# EAGLE schematic Schematics (EAGLE 6.2)
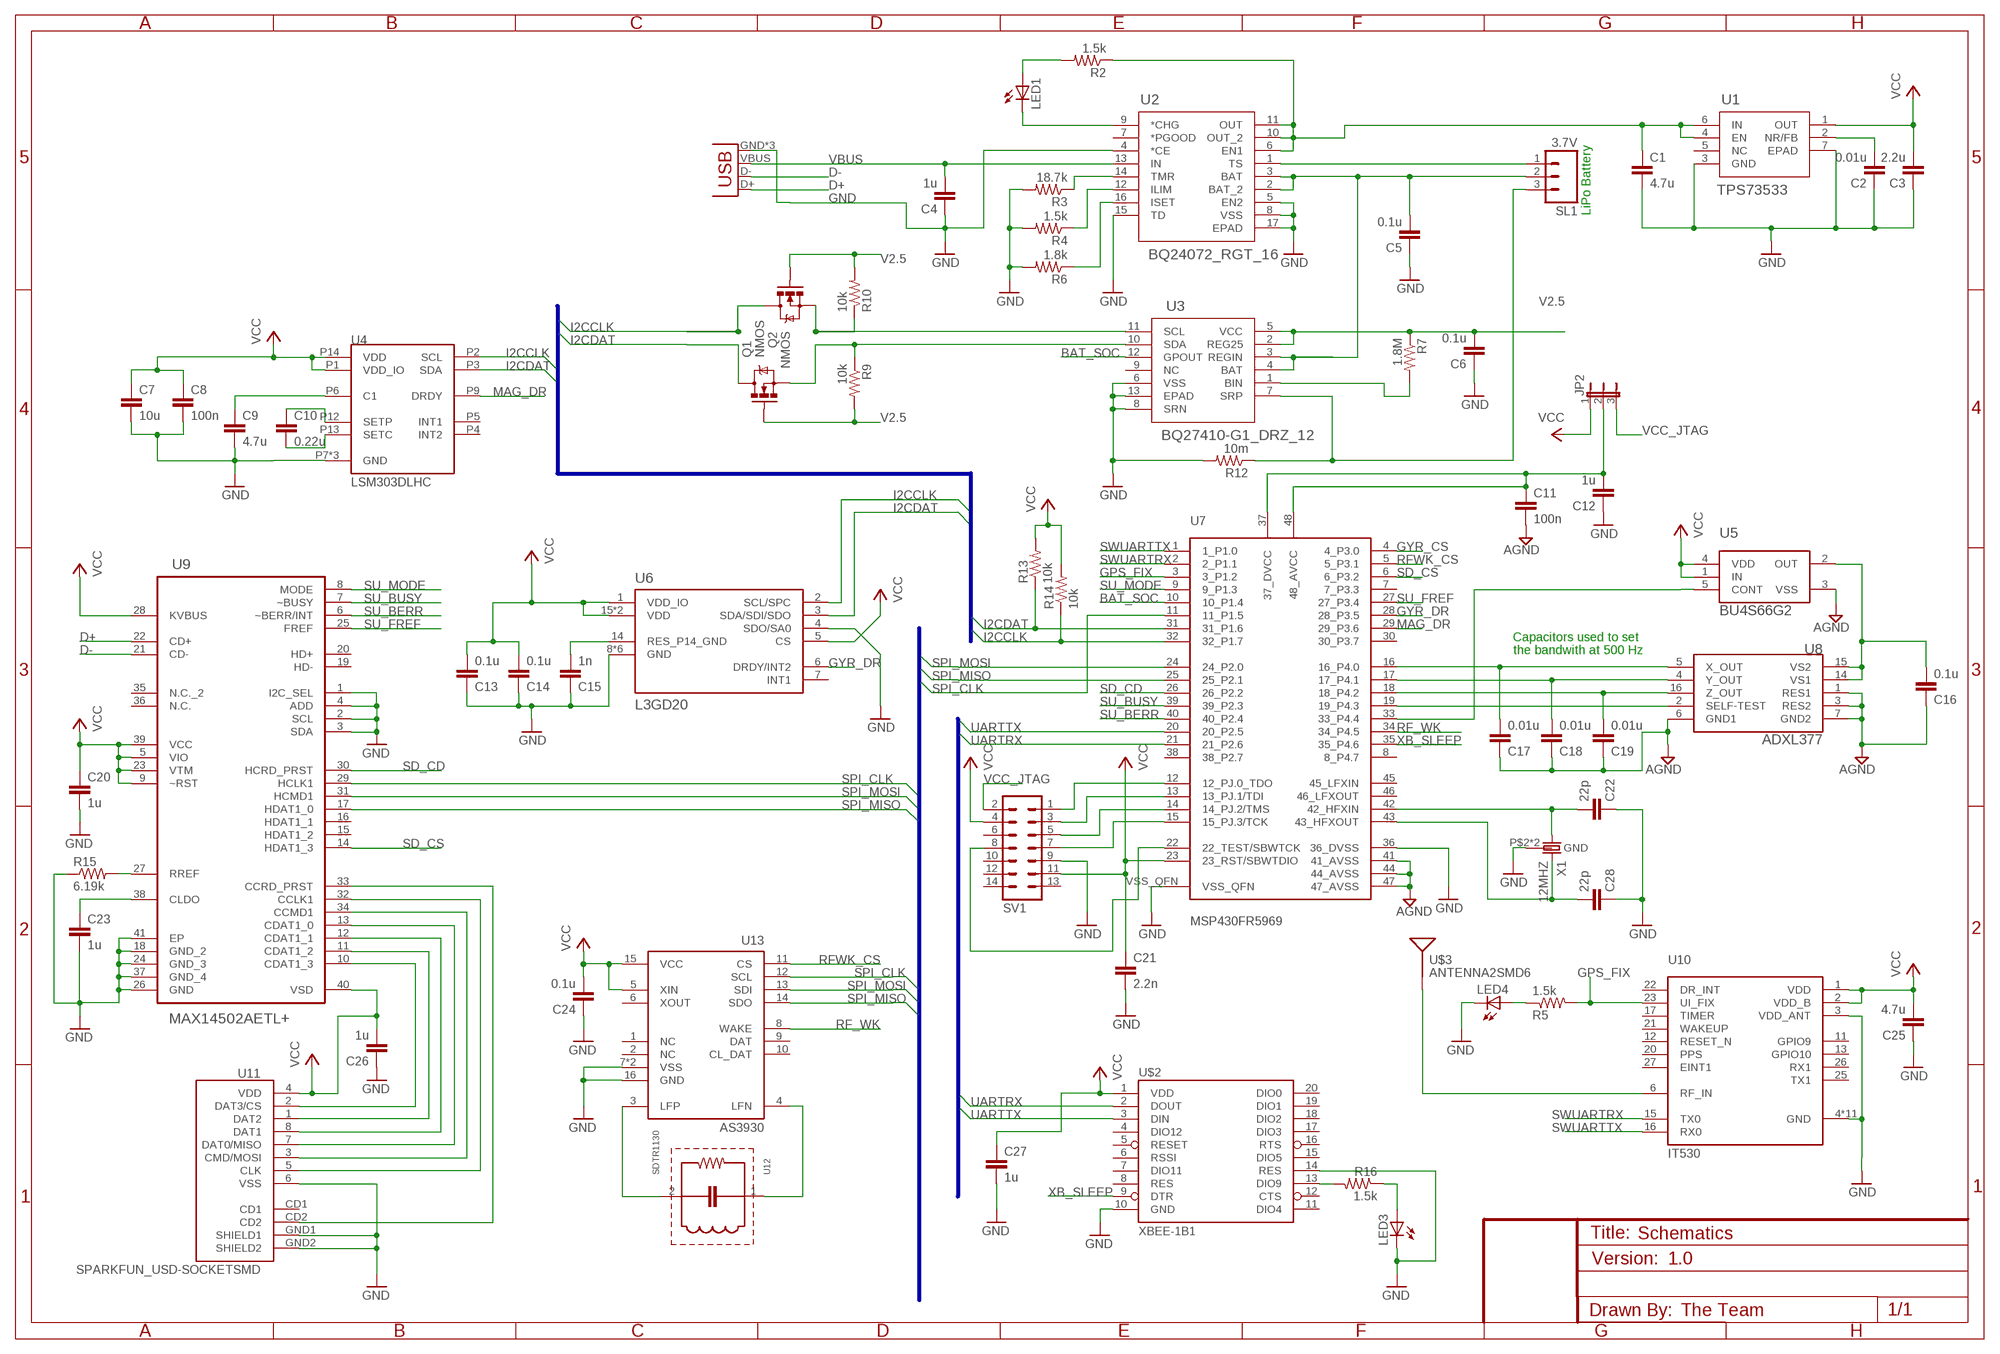
[diagram p0: schematic, sheet 1]

## Parts
C1  4.7u  C-EUC0603  [C0603]
C2  0.01u  C-EUC0603  [C0603]
C3  2.2u  C-EUC0603  [C0603]
C4  1u  C-EUC0603  [C0603]
C5  0.1u  C-EUC0603  [C0603]
C6  0.1u  C-EUC0603  [C0603]
C7  10u  C-EUC0603  [C0603]
C8  100n  C-EUC0603  [C0603]
C9  4.7u  C-EUC0603  [C0603]
C10  0.22u  C-EUC0603  [C0603]
C11  100n  C-EUC0603  [C0603]
C12  1u  C-EUC0603  [C0603]
C13  0.1u  C-EUC0603  [C0603]
C14  0.1u  C-EUC0603  [C0603]
C15  1n  C-EUC0603  [C0603]
C16  0.1u  C-EUC0603  [C0603]
C17  0.01u  C-EUC0603  [C0603]
C18  0.01u  C-EUC0603  [C0603]
C19  0.01u  C-EUC0603  [C0603]
C20  1u  C-EUC0603  [C0603]
C21  2.2n  C-EUC0603  [C0603]
C22  22p  C-EUC0603  [C0603]
C23  1u  C-EUC0603  [C0603]
C24  0.1u  C-EUC0603  [C0603]
C25  4.7u  C-EUC0603  [C0603]
C26  1u  C-EUC0603  [C0603]
C27  1u  C-EUC0603  [C0603]
C28  22p  C-EUC0603  [C0603]
JP1  USB-MICROB  [USB-MICROB]
JP2  JP2E  [JP2]
LED1  LED  [SMARTLED-TTW]
LED3  LED  [SMARTLED-TTW]
LED4  LED  [SMARTLED-TTW]
Q1  NMOS  MOSFET-NCHANNELBSS138  [SOT23]
Q2  NMOS  MOSFET-NCHANNELBSS138  [SOT23]
R2  1.5k  R-US_R0603  [R0603]
R3  18.7k  R-US_R0603  [R0603]
R4  1.5k  R-US_R0603  [R0603]
R5  1.5k  R-US_R0603  [R0603]
R6  1.8k  R-US_R0603  [R0603]
R7  1.8M  R-US_R0603  [R0603]
R9  10k  R-US_R0603  [R0603]
R10  10k  R-US_R0603  [R0603]
R12  10m  R-US_R0603  [R0603]
R13  10k  R-US_R0603  [R0603]
R14  10k  R-US_R0603  [R0603]
R15  6.19k  R-US_R0603  [R0603]
R16  1.5k  R-US_R0603  [R0603]
SL1  3.7V  M03  [03P]
SV1  ML14L  [ML14L]
U1  TPS73533  TPS73533_DRV_6  [DRV6_1P6X1]
U2  BQ24072_RGT_16  [RGT16_1P7X1P7]
U3  BQ27410-G1_DRZ_12  [DRZ12_1P95X2P45]
U4  LSM303DLHC  [LGA_3X5X1_14L]
U5  BU4S66G2  [SSOP5]
U6  L3GD20  [L3GD20]
U7  MSP430FR5969  [RGZ(S-PQFP-N48)]
U8  ADXL377  [LFCSP-16]
U9  MAX14502AETL+  [QFN40P500X500X80-41N]
U10  IT530  [IT530]
U11  SPARKFUN_USD-SOCKETSMD  [SPARKFUN_MICRO-SD-SOCKET-PP]
U12  SDTR1130  [SDTR1130-SMD]
U13  AS3930  [AS3930]
U$2  XBEE-1B1  [XBEE-1]
U$3  ANTENNA2SMD6  [ANTENNA-CHIP6]
X1  12MHZ  [12MHZ]

## Nets
AGND: C11.2 C16.1 C17.1 C18.1 C19.1 U5.3(VSS) U7.41(41_AVSS) U7.44(44_AVSS) U7.47(47_AVSS) U8.1(RES1) U8.3(RES2) U8.6(GND1) U8.7(GND2)
BAT_SOC: U3.12(GPOUT) U7.10(10_P1.4)
D+: JP1.D+ U9.22(CD+)
D-: JP1.D- U9.21(CD-)
GND: C1.2 C2.1 C3.1 C4.1 C5.1 C6.1 C7.2 C8.2 C9.2 C12.1 C13.1 C14.1 C15.1 C20.2 C21.2 C22.1 C23.2 C24.1 C25.1 C26.1 C27.2 C28.1 JP1.GND JP1.MT1(GND) JP1.MT2(GND) LED3.C@1(C) LED4.C@1(C) R3.2 R4.2 R6.2 R12.2 R15.1 SV1.9 U1.3(GND) U1.7(EPAD) U2.4(*CE) U2.5(EN2) U2.8(VSS) U2.15(TD) U2.17(EPAD) U3.6(VSS) U3.8(SRN) U3.13(EPAD) U4.P7(GND) U4.P10(GND) U4.P11(GND) U6.4(SDO/SA0) U6.8(GND) U6.9(GND) U6.10(GND) U6.11(GND) U6.12(GND) U6.13(GND) U7.36(36_DVSS) U7.VSS_QFN U9.1(I2C_SEL) U9.2(SCL) U9.3(SDA) U9.4(ADD) U9.18(GND_2) U9.24(GND_3) U9.26(GND) U9.37(GND_4) U9.41(EP) U10.3(VDD_ANT) U10.4(GND) U10.5(GND) U10.7(GND) U10.8(GND) U10.9(GND) U10.10(GND) U10.14(GND) U10.18(GND) U10.19(GND) U10.24(GND) U10.28(GND) U11.6(VSS) U11.GND1(SHIELD1) U11.GND2(SHIELD2) U13.7(VSS) U13.16(GND) U13.EXP(VSS) U$2.10(GND) U$2.14(RES) X1.P$2(GND) X1.P$4(GND)
GPS_FIX: R5.2 U7.3(3_P1.2) U10.23(UI_FIX)
GYR_CS: U7.4(4_P3.0)
GYR_DR: U6.6(DRDY/INT2) U7.28(28_P3.5)
I2CCLK: Q2.3(D) R14.1 U4.P2(SCL) U6.2(SCL/SPC) U7.32(32_P1.7)
I2CDAT: Q1.3(D) R13.1 U4.P3(SDA) U6.3(SDA/SDI/SDO) U7.31(31_P1.6)
MAG_DR: U4.P9(DRDY) U7.29(29_P3.6)
N$1: U5.5(CONT) U7.33(33_P4.4)
N$2: C16.2 U5.2(OUT) U8.14(VS1) U8.15(VS2)
N$3: LED3.A@1(A) R16.1
N$4: R16.2 U$2.13(DIO9)
N$5: U7.19(19_P4.3) U8.2(SELF-TEST)
N$6: Q1.2(S) R9.1 U3.10(SDA)
N$7: LED1.C@1(C) U2.9(*CHG)
N$8: C15.2 U6.14(RES_P14_GND)
N$9: SV1.1 U7.12(12_PJ.0_TDO)
N$10: C11.1 C12.2 JP2.2 U7.37(37_DVCC) U7.48(48_AVCC)
N$11: SV1.3 U7.13(13_PJ.1/TDI)
N$12: C22.2 U7.42(42_HFXIN) X1.P$1
N$13: C1.1 R2.1 U1.4(EN) U1.6(IN) U2.6(EN1) U2.10(OUT_2) U2.11(OUT)
N$14: U10.6(RF_IN) U$3.1(SIGNAL)
N$15: C28.2 U7.43(43_HFXOUT) X1.P$3
N$16: U9.10(CDAT1_3) U11.2(DAT3/CS)
N$17: U9.11(CDAT1_2) U11.1(DAT2)
N$18: C17.2 U7.16(16_P4.0) U8.5(X_OUT)
N$19: U9.12(CDAT1_1) U11.8(DAT1)
N$20: C18.2 U7.17(17_P4.1) U8.4(Y_OUT)
N$21: C19.2 U7.18(18_P4.2) U8.16(Z_OUT)
N$22: R7.2 U3.1(BIN)
N$23: U9.13(CDAT1_0) U11.7(DAT0/MISO)
N$24: Q2.2(S) R10.1 U3.11(SCL)
N$25: C9.1 U4.P6(C1)
N$26: C10.1 U4.P12(SETP)
N$27: C10.2 U4.P13(SETC)
N$28: R6.1 U2.16(ISET)
N$29: R4.1 U2.12(ILIM)
N$30: R3.1 U2.14(TMR)
N$31: C2.2 U1.2(NR/FB)
N$32: U9.34(CCMD1) U11.3(CMD/MOSI)
N$33: R12.1 SL1.3 U3.7(SRP)
N$34: SV1.5 U7.14(14_PJ.2/TMS)
N$35: LED1.A@1(A) R2.2
N$37: U9.32(CCLK1) U11.5(CLK)
N$38: SV1.7 U7.15(15_PJ.3/TCK)
N$39: C5.2 SL1.2 U2.2(BAT_2) U2.3(BAT) U3.3(REGIN) U3.4(BAT)
N$40: SL1.1 U2.1(TS)
N$43: U9.33(CCRD_PRST) U11.CD2
N$44: SV1.8 U7.22(22_TEST/SBWTCK)
N$45: U12.2 U13.3(LFP)
N$46: R15.2 U9.27(RREF)
N$47: U12.1 U13.4(LFN)
N$48: C23.1 U9.38(CLDO)
N$49: LED4.A@1(A) R5.1
RF_WK: U7.34(34_P4.5) U13.8(WAKE)
RFWK_CS: U7.5(5_P3.1) U13.11(CS)
SD_CD: U7.26(26_P2.2) U9.30(HCRD_PRST)
SD_CS: U7.6(6_P3.2) U9.14(HDAT1_3)
SPI_CLK: U7.11(11_P1.5) U9.29(HCLK1) U13.12(SCL)
SPI_MISO: U7.25(25_P2.1) U9.17(HDAT1_0) U13.14(SDO)
SPI_MOSI: U7.24(24_P2.0) U9.31(HCMD1) U13.13(SDI)
SU_BERR: U7.40(40_P2.4) U9.6(~BERR/INT)
SU_BUSY: U7.39(39_P2.3) U9.7(~BUSY)
SU_FREF: U7.27(27_P3.4) U9.25(FREF)
SU_MODE: U7.9(9_P1.3) U9.8(MODE)
SWUARTRX: U7.2(2_P1.1) U10.15(TX0)
SWUARTTX: U7.1(1_P1.0) U10.16(RX0)
UARTRX: U7.21(21_P2.6) U$2.2(DOUT)
UARTTX: U7.20(20_P2.5) U$2.3(DIN)
V2.5: C6.2 Q1.1(G) Q2.1(G) R7.1 R9.2 R10.2 U3.2(REG25) U3.5(VCC)
VBUS: C4.2 JP1.VBUS U2.13(IN)
VCC: C3.2 C7.1 C8.1 C13.2 C14.2 C20.1 C21.1 C24.2 C25.2 C26.2 C27.1 JP2.1 R13.2 R14.2 SV1.4 SV1.11 U1.1(OUT) U4.P1(VDD_IO) U4.P14(VDD) U5.1(IN) U5.4(VDD) U6.1(VDD_IO) U6.5(CS) U6.15(VDD) U6.16(VDD) U7.23(23_RST/SBWTDIO) U9.5(VIO) U9.9(~RST) U9.23(VTM) U9.28(KVBUS) U9.39(VCC) U9.40(VSD) U10.1(VDD) U10.2(VDD_B) U11.4(VDD) U13.5(XIN) U13.15(VCC) U$2.1(VDD)
VCC_JTAG: JP2.3 SV1.2
XB_SLEEP: U7.35(35_P4.6) U$2.9(DTR)
Unconnected: SV1.6 SV1.10 SV1.12 SV1.13 SV1.14 U1.5(NC) U2.7(*PGOOD) U3.9(NC) U4.P4(INT2) U4.P5(INT1) U6.7(INT1) U7.7(7_P3.3) U7.8(8_P4.7) U7.30(30_P3.7) U7.38(38_P2.7) U7.45(45_LFXIN) U7.46(46_LFXOUT) U9.15(HDAT1_2) U9.16(HDAT1_1) U9.19(HD-) U9.20(HD+) U9.35(N.C._2) U9.36(N.C.) U10.11(GPIO9) U10.12(RESET_N) U10.13(GPIO10) U10.17(TIMER) U10.20(PPS) U10.21(WAKEUP) U10.22(DR_INT) U10.25(TX1) U10.26(RX1) U10.27(EINT1) U11.CD1 U13.1(NC) U13.2(NC) U13.6(XOUT) U13.9(DAT) U13.10(CL_DAT) U$2.4(DIO12) U$2.5(RESET) U$2.6(RSSI) U$2.7(DIO11) U$2.8(RES) U$2.11(DIO4) U$2.12(CTS) U$2.15(DIO5) U$2.16(RTS) U$2.17(DIO3) U$2.18(DIO2) U$2.19(DIO1) U$2.20(DIO0)

## Buses
I2CDAT,I2CCLK
SPI_CLK,SPI_MOSI,SPI_MISO
UARTTX,UARTRX

## Notes on the sheet
- LiPo Battery
- Capacitors used to set
- the bandwith at 500 Hz

## Library data of the parts
C1-C28 = rcl:C-EU: CAPACITOR, European symbol
JP1 = SparkFun-Connectors:USB: USB Connectors USB-B-PTH is fully proven SKU : PRT-00139/CONN-08278 USB-miniB is fully proven SKU : PRT-00587 USB-A-PCB is untested. USB-A-H is throughly reviewed, but untested. Spark Fun Electronics SKU : PRT-00437 USB-B-SMT is throughly reviewed, but untested. Needs silkscreen touching up. USB-A-S has not been used/tested USB-MB-H has not been used/tested USB-MICROB has been used. CONN-09505; PROD_ID: CONN-09505
JP2 = jumper:JP2E: JUMPER
LED1 LED3 LED4 = led:LED: LED OSRAM: - CHIPLED LG R971, LG N971, LY N971, LG Q971, LY Q971, LO R971, LY R971 LH N974, LH R974 LS Q976, LO Q976, LY Q976 LO Q996 - Hyper CHIPLED LW Q18S LB Q993, LB Q99A, LB R99A - SideLED LS A670, LO A670, LY A670, LG A670, LP A670 LB A673, LV A673, LT A673, LW A673 LH A674 LY A675 LS A676, LA A676, LO A676, LY A676, LW A676 LS A679, LY A679, LG A679 - Hyper Micro SIDELED® LS Y876, LA Y876, LO Y876, LY Y876 LT Y87S - SmartLED LW L88C, LW L88S LB L89C, LB L89S, LG L890 LS L89K, LO L89K, LY L89K LS L896, LA L896, LO L896, LY L896 - TOPLED LS T670, LO T670, LY T670, LG T670, LP T670 LSG T670, LSP T670, LSY T670, LOP T670, LYG T670 LG T671, LOG T671, LSG T671 LB T673, LV T673, LT T673, LW T673 LH T674 LS T676, LA T676, LO T676, LY T676, LB T676, LH T676, LSB T676, LW T676 LB T67C, LV T67C, LT T67C, LS T67K, LO T67K, LY T67K, LW E67C LS E67B, LA E67B, LO E67B, LY E67B, LB E67C, LV E67C, LT E67C LW T67C LS T679, LY T679, LG T679 LS T770, LO T770, LY T770, LG T770, LP T770 LB T773, LV T773, LT T773, LW T773 LH T774 LS E675, LA E675, LY E675, LS T675 LS T776, LA T776, LO T776, LY T776, LB T776 LHGB T686 LT T68C, LB T68C - Hyper Mini TOPLED® LB M676 - Mini TOPLED Santana® LG M470 LS M47K, LO M47K, LY M47K Source: http://www.osram.convergy.de LUXEON: - LUMILED® LXK2-PW12-R00, LXK2-PW12-S00, LXK2-PW14-U00, LXK2-PW14-V00 LXK2-PM12-R00, LXK2-PM12-S00, LXK2-PM14-U00 LXK2-PE12-Q00, LXK2-PE12-R00, LXK2-PE12-S00, LXK2-PE14-T00, LXK2-PE14-U00 LXK2-PB12-K00, LXK2-PB12-L00, LXK2-PB12-M00, LXK2-PB14-N00, LXK2-PB14-P00, LXK2-PB14-Q00 LXK2-PR12-L00, LXK2-PR12-M00, LXK2-PR14-Q00, LXK2-PR14-R00 LXK2-PD12-Q00, LXK2-PD12-R00, LXK2-PD12-S00 LXK2-PH12-R00, LXK2-PH12-S00 LXK2-PL12-P00, LXK2-PL12-Q00, LXK2-PL12-R00 Source: www.luxeon.com KINGBRIGHT: KA-3528ASYC Source: www.kingbright.com
Q1 Q2 = SparkFun-DiscreteSemi:MOSFET-NCHANNEL: Common NMOSFET Parts MFG P/N Store ID Prod ID FDD8780 TRANS-09984 SI7820DN TRANS-11055 FDS6630A IC-08089 2N7002PW TRANS-11151 FQP30N06L COM-10213 TRANS-10060 BSS123LT1G TRANS-08345 BSS138 TRANS-00830 BS170 2N7000; PROD_ID: TRANS-00830
R2-R7 R9 R10 R12-R16 = rcl:R-US_: RESISTOR, American symbol
SL1 = con-amp-quick:M03: AMP QUICK CONNECTOR; OC_FARNELL: unknown; OC_NEWARK: unknown
SV1 = con-ml:ML14L: HARTING; OC_FARNELL: unknown; OC_NEWARK: unknown
U1 = Micro2:TPS73533_DRV_6; DATASHEETURL: http://www.ti.com/lit/gpn/TPS73533; DESCRIPTION: Single Output LDO, 500mA, Fixed (3.3V), Low Quiescent Current, Low Noise, High PSRR; FAMILY_NAME: SINGLE CHANNEL LDO; GENERIC_PART_NUMBER: TPS73533; INDUSTRY_STD_PKG_TYPE: SON; MANUFACTURER: Texas Instruments; MANUFACTURER_PART_NUMBER: tps73533_drv_6; PACKAGE_DESIGNATOR: DRV; PIN_COUNT: 6; VENDOR: Texas Instruments
U2 = Micro2:BQ24072_RGT_16; DATASHEETURL: http://www.ti.com/lit/gpn/BQ24072; DESCRIPTION: USB-Friendly Li-Ion Battery Charger and Power-Path Management IC, Vout 200mV above Vbat; FAMILY_NAME: BATTERY CHARGE MANAGEMENT; GENERIC_PART_NUMBER: BQ24072; INDUSTRY_STD_PKG_TYPE: QFN; MANUFACTURER: Texas Instruments; PACKAGE_DESIGNATOR: RGT; PIN_COUNT: 16
U3 = Micro2:BQ27410-G1_DRZ_12; DATASHEETURL: http://www.ti.com/lit/gpn/BQ27410-G1; DESCRIPTION: System-Side Impedance Track Fuel Gauge With Direct Battery Connection; FAMILY_NAME: BATTERY FUEL GAUGE; GENERIC_PART_NUMBER: BQ27410-G1; INDUSTRY_STD_PKG_TYPE: SON; MANUFACTURER: Texas Instruments; PACKAGE_DESIGNATOR: DRZ; PIN_COUNT: 12
U4 = Micro2:LSM303DLHC
U5 = Micro2:BU4S66G2
U6 = Micro2:L3GD20: L3GD20
U7 = hijack:MSP430FR5969
U8 = Micro2:ADXL377
U9 = Micro2:MAX14502AETL+: Hi-Speed USB-to-SD Card Readers with Bypass; MPN: MAX14502AETL+; OC_FARNELL: -; OC_NEWARK: 09R0393; PACKAGE: TQFN-40; SUPPLIER: Maxim
U10 = Micro2:IT530: IT530 Datasheet <http://www.u-blox.com/images/downloads/Product_Docs/IT530_DataSheet_%28FTX-HW-12008%29.pdf>
U11 = Micro2:SPARKFUN_USD-SOCKET: microSD Socket Push-push type uSD socket. Schematic element and footprint production proven. Spark Fun Electronics SKU : PRT-00127. tDoc lines correctly indicate media card edge positions when inserting (unlocked, locked, depressed).
U12 = Micro2:SDTR1130
U13 = Micro2:AS3930: AS3930
U$2 = SparkFun-RF:XBEE-1: Xbee module footprints SMT header is CONN-09042.
U$3 = SparkFun-RF:ANTENNA2: Chip antenna Single endded antenna. Common with smaller chip antennas. CHIP4 package is the GPS Chip Antenna SKU: GPS-08418. CHIP5 package is 2.4GHz chip antenna SKU: WRL-00144.
X1 = 12Mhz:12MHZ